# EAGLE design RELR4 (EAGLE 5.06)
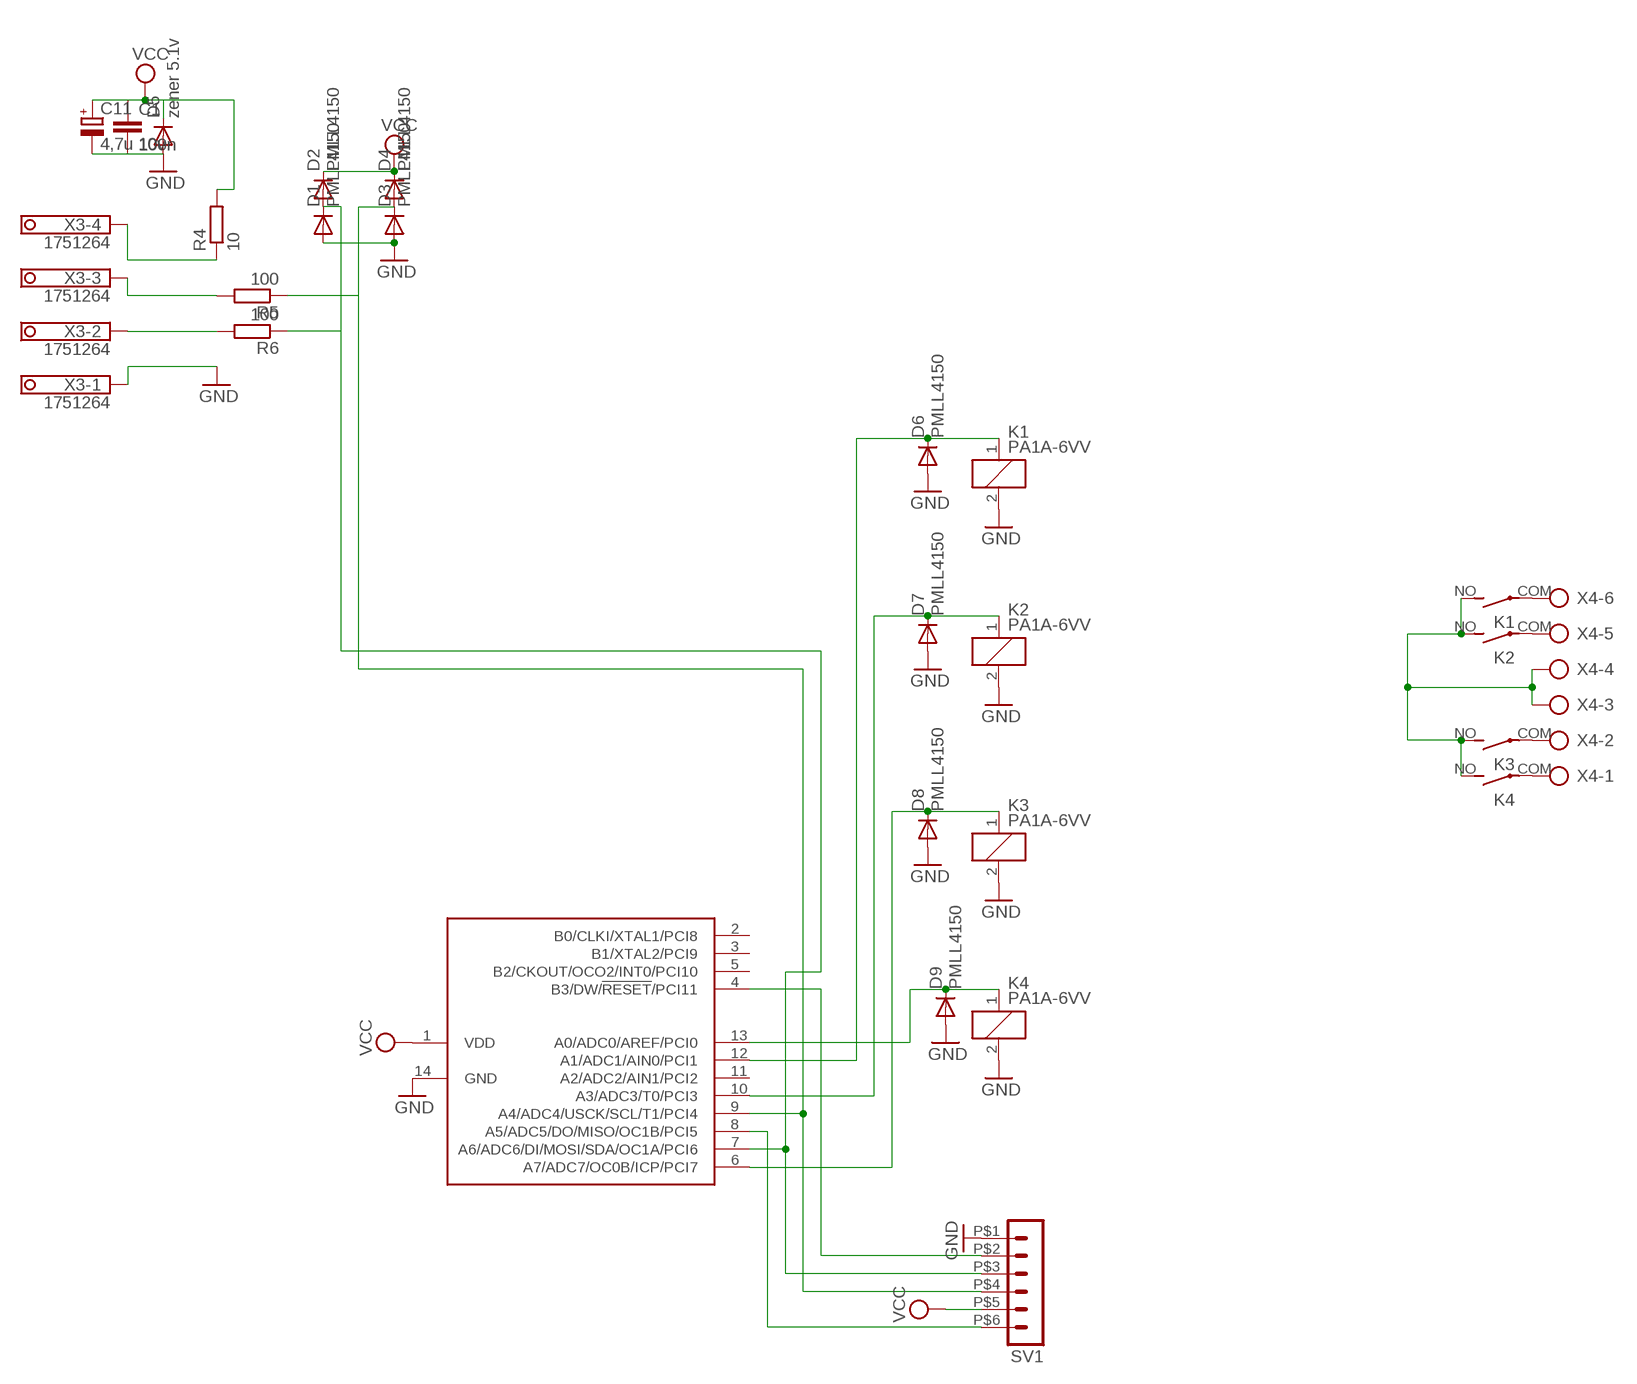
[diagram p0: schematic, sheet 1]

## Parts
C1  100n  C-EUC0805  [C0805]
C11  4,7u 10v  CPOL-EUB/3528-21R  [B/3528-21R]
D1  PMLL4150  [SOD80C]
D2  PMLL4150  [SOD80C]
D3  PMLL4150  [SOD80C]
D4  PMLL4150  [SOD80C]
D5  zener 5.1v  PMLL4150  [SOD80C]
D6  PMLL4150  [SOD80C]
D7  PMLL4150  [SOD80C]
D8  PMLL4150  [SOD80C]
D9  PMLL4150  [SOD80C]
K1  PA1A-6VV  [PA]
K2  PA1A-6VV  [PA]
K3  PA1A-6VV  [PA]
K4  PA1A-6VV  [PA]
R4  10  R-EU_R0805  [R0805]
R5  100  R-EU_R0805  [R0805]
R6  100  R-EU_R0805  [R0805]
SV1  MA06-1'  [MA06-1_SMD_MINI]
U$1  TINY24'  [SOIC14]
X3  1751264  [1751264]
X4  AK500/6  [AK500/6]

## Nets
GND: C1.2 C11.- D1.A D3.A D5.A D6.A D7.A D8.A D9.A K1.2 K2.2 K3.2 K4.2 SV1.P$1 U$1.14(GND) X3.1
MISO: D1.C D2.A R6.1 SV1.P$3 U$1.7(A6/ADC6/DI/MOSI/SDA/OC1A/PCI6)
N$1: K1.COM(2:P) X4.6
N$2: K2.COM(2:P) X4.5
N$3: K3.COM(2:P) X4.2
N$4: K4.COM(2:P) X4.1
N$9: SV1.P$2 U$1.4(B3/DW/!RESET!/PCI11)
N$16: R6.2 X3.2
N$17: R5.2 X3.3
N$18: R4.1 X3.4
N$19: D6.C K1.1 U$1.12(A1/ADC1/AIN0/PCI1)
N$23: D7.C K2.1 U$1.10(A3/ADC3/T0/PCI3)
N$24: D8.C K3.1 U$1.6(A7/ADC7/OC0B/ICP/PCI7)
N$27: D9.C K4.1 U$1.13(A0/ADC0/AREF/PCI0)
N$28: SV1.P$6 U$1.8(A5/ADC5/DO/MISO/OC1B/PCI5)
P: K1.NO(2:S) K2.NO(2:S) K3.NO(2:S) K4.NO(2:S) X4.3 X4.4
SCK: D3.C D4.A R5.1 SV1.P$4 U$1.9(A4/ADC4/USCK/SCL/T1/PCI4)
VCC: C1.1 C11.+ D2.C D4.C D5.C R4.2 SV1.P$5 U$1.1(VDD)
Unconnected: U$1.2(B0/CLKI/XTAL1/PCI8) U$1.3(B1/XTAL2/PCI9) U$1.5(B2/CKOUT/OCO2/INT0/PCI10) U$1.11(A2/ADC2/AIN1/PCI2)

## Library data of the parts
C1 = rcl:C-EU: CAPACITOR, European symbol
C11 = rcl:CPOL-EU: POLARIZED CAPACITOR, European symbol
D1-D9 = diode:PMLL4150: DIODE high speed
K1-K4 = relay:PA?*: SLIM POWER RELAY NAiS Source: http://www.mew-europe.com/.. en_ds_61123_0000.pdf
R4-R6 = rcl:R-EU_: RESISTOR, European symbol
SV1 = con-lstb:MA06-1: PIN HEADER
U$1 = atmel:TINY24
X3 = con-phoenix-350:1751264: MKDS 1/ 4-3,5 Printklemme Nennstrom: 10 A Bemessungsspannung: 160 V Raster: 3,5 mm Polzahl: 4 Montageart: Löten Anschlussart: Schraubanschluss Anschlussrichtung vom Leiter zur Platine: 0° Source: http://eshop.phoenixcontact.com .. 1751264.pdf
X4 = con-ptr500:AK500/6: CONNECTOR

## Board
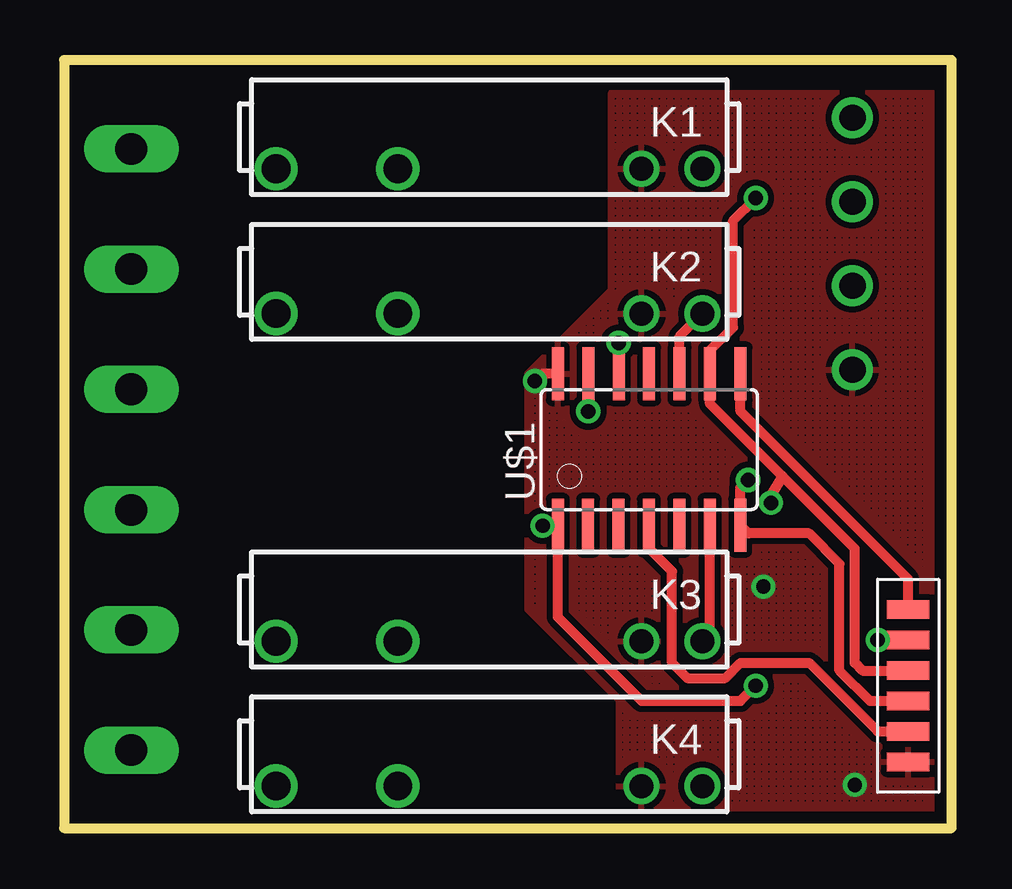
[diagram p1: board, top side]
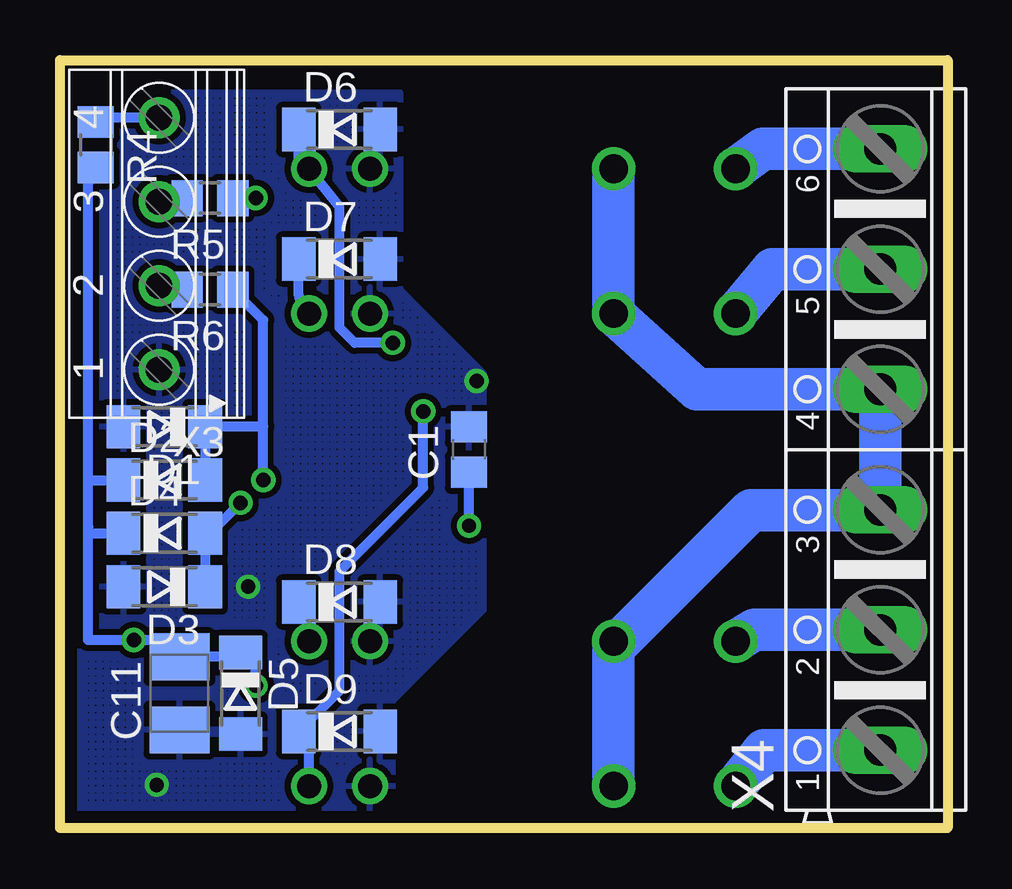
[diagram p2: board, bottom side, seen from below]

Size 37 x 32 mm. Coordinates in mm from the lower left corner, seen from the top.
Outline: 37,32 0,32 0,0 37,0 37,32
Copper layers (1*16): Top 0.035mm / dielectric 1.5mm / Bottom 0.035mm
Design rules "default *": minimum track width 10mil, minimum drill 16mil, track to track 8mil, track to pad 8mil, pad to pad 8mil, via to via 8mil, smd to smd 0mil, copper to edge 20mil, drill to drill 8mil, minimum pad ring 10mil, minimum via ring 8mil, stop-mask expansion 4mil, vias tented up to drill 0mil, thermal gap 10mil

### Footprints (pad centres in the part's own frame; a part is rotated, then mirrored left to right if it is on the bottom)
C0805 = smd 1.3 x 1.5: 1 -0.95,0; 2 0.95,0
B/3528-21R = smd 1.95 x 2.5: + 1.525,0; - -1.525,0
SOD80C = smd 1.4 x 1.8: A 1.7,0; C -1.7,0
PA = drill 1 round: 1 -8.89,1.32; 2 -6.35,1.32 | drill 1.2 round: COM 8.89,1.32; NO 3.81,1.32
R0805 = smd 1.3 x 1.5: 1 -0.95,0; 2 0.95,0
MA06-1_SMD_MINI = smd 0.762 x 1.778: P$1 -3.81,0; P$2 -2.54,0; P$3 -1.27,0; P$4 0,0; P$5 1.27,0; P$6 2.54,0
SOIC14 = smd 0.5 x 2.2: 1 -3.175,-3.154; 2 -1.915,-3.154; 3 -0.645,-3.154; 4 0.625,-3.154; 5 1.895,-3.154; 6 3.165,-3.154; 7 4.435,-3.154; 8 4.445,3.154; 9 3.175,3.154; 10 1.905,3.154; 11 0.635,3.154; 12 -0.635,3.154; 13 -1.905,3.154; 14 -3.175,3.154
1751264 = drill 1.1 pad 1.7 round: 1 -5.25,-0.1; 2 -1.75,-0.1; 3 1.75,-0.1; 4 5.25,-0.1
AK500/6 = drill 1.321 long: 1 -12.522,0; 2 -7.518,0; 3 -2.515,0; 4 2.515,0; 5 7.518,0; 6 12.522,0

### Placement (x,y rotation side)
C1  19.95,15.77 90 bottom
C11  32.02,5.61 90 bottom
D1  32.65,16.72 180 bottom
D2  32.65,14.5 0 bottom
D3  32.65,10.05 180 bottom
D4  32.65,12.28 0 bottom
D5  29.48,5.61 270 bottom
D6  25.35,29.11 0 bottom
D7  25.35,23.71 0 bottom
D8  25.35,9.42 0 bottom
D9  25.35,4.02 0 bottom
K1  17.73,28.79 180 top
K2  17.73,22.75 180 top
K3  17.73,9.1 180 top
K4  17.73,3.07 180 top
R4  35.51,28.47 270 bottom
R5  30.74,26.25 180 bottom
R6  30.74,22.44 180 bottom
SV1  35.19,6.56 90 top
U$1  23.76,15.77 0 top
X3  32.97,24.34 90 bottom
X4  2.8,15.77 90 bottom

### Tracks (layer width: path | path; a pad name or v marks a point on that pad's centre or on a via)
GND  (via drill 0.6)
  Top 0.406: U$1.14 19.93,18.92 v19.63,18.63
  other vias: 32.97,1.8 29.16,10.05
  pour Bottom (isolate 0.254, hatched): 23.12,-0.1 23.12,5.29 19.32,9.1 19.32,18.94 22.81,22.44 22.81,30.64 37.09,30.64 37.09,-0.1
  pour Top (isolate 0.254, hatched): 23.12,-0.1 23.12,5.29 19.32,9.1 19.32,18.94 22.81,22.44 22.81,30.64 37.09,30.64 37.09,-0.1
MISO  (via drill 0.6)
  Top 0.406: v28.52,14.5 28.2,14.17 U$1.7 28.53,12.28 31.06,12.28 32.33,11.01 32.33,6.56 33.6,5.29 SV1.P$3
  Bottom 0.406: v28.52,14.5 28.52,16.72 | 28.52,16.72 28.52,21.17 R6.1 | 28.52,16.72 D1.C D2.A
N$1
  Bottom 1.778: X4.6 7.7,28.29 K1.COM
N$2
  Bottom 1.778: X4.5 7.3,23.29 K2.COM
N$3
  Bottom 1.778: X4.2 8.05,8.25 K3.COM
N$4
  Bottom 1.778: X4.1 7.66,3.25 K4.COM
N$9
  Top 0.406: U$1.4 24.38,11.65 25.35,10.69 25.35,6.88 25.98,6.24 27.57,6.24 28.2,6.88 31.06,6.88 33.92,4.02 SV1.P$2
N$16
  Bottom 0.406: R6.2 32.71,22.44 X3.2
N$17
  Bottom 0.406: X3.3 31.85,26.09 R5.2
N$18
  Bottom 0.406: X3.4 35.34,29.59 R4.1
N$19  (via drill 0.6)
  Top 0.406: U$1.12 v23.12,20.22
  Bottom 0.406: D6.C 27.05,27.58 K1.1 25.35,25.88 25.35,20.85 24.71,20.22 v23.12,20.22
N$23
  Top 0.406: U$1.10 25.66,20.48 K2.1
  Bottom 0.406: D7.C 27.05,22.18 K2.1
N$24
  Top 0.406: U$1.6 26.93,7.77 K3.1
  Bottom 0.406: K3.1 26.62,8.99 D8.C
N$27  (via drill 0.6)
  Top 0.406: v21.86,17.36 U$1.13
  Bottom 0.406: K4.1 26.62,3.59 D9.C 25.35,5.72 25.35,10.69 21.86,14.18 v21.86,17.36
N$28
  Top 0.406: U$1.8 28.2,17.36 35.19,10.37 SV1.P$6
P
  Bottom 1.778: K4.NO K3.NO 13.92,7.52 8.2,13.23 2.83,13.23 X4.3 X4.4 10.45,18.28 K2.NO K1.NO
SCK  (via drill 0.6)
  Top 0.406: v28.84,26.25 27.89,25.3 27.89,20.85 26.94,19.9 U$1.9 26.94,17.67 29.95,14.66 | SV1.P$4 33.28,6.56 32.97,6.88 32.97,11.64 29.95,14.66 | v29.48,13.55 29.48,13.87 29.95,14.66
  Bottom 0.406: v28.84,26.25 R5.1 | D3.C D4.A 30.74,12.28 v29.48,13.55
VCC  (via drill 0.6)
  Top 0.406: v28.84,5.93 28.2,5.29 24.08,5.29 20.59,8.78 U$1.1 19.97,12.62 v19.95,12.59 | v33.92,7.83 SV1.P$5
  Bottom 0.406: v19.95,12.59 C1.1 | v28.84,5.93 28.84,6.67 D5.C 29.65,7.13 C11.+ 32.71,7.83 v33.92,7.83 35.83,7.83 35.83,12.59 | R4.2 35.51,27.2 35.83,26.88 35.83,14.5 | 35.83,12.59 35.83,14.5 | D4.C 35.83,12.28 35.83,12.59 | 35.83,14.5 D2.C